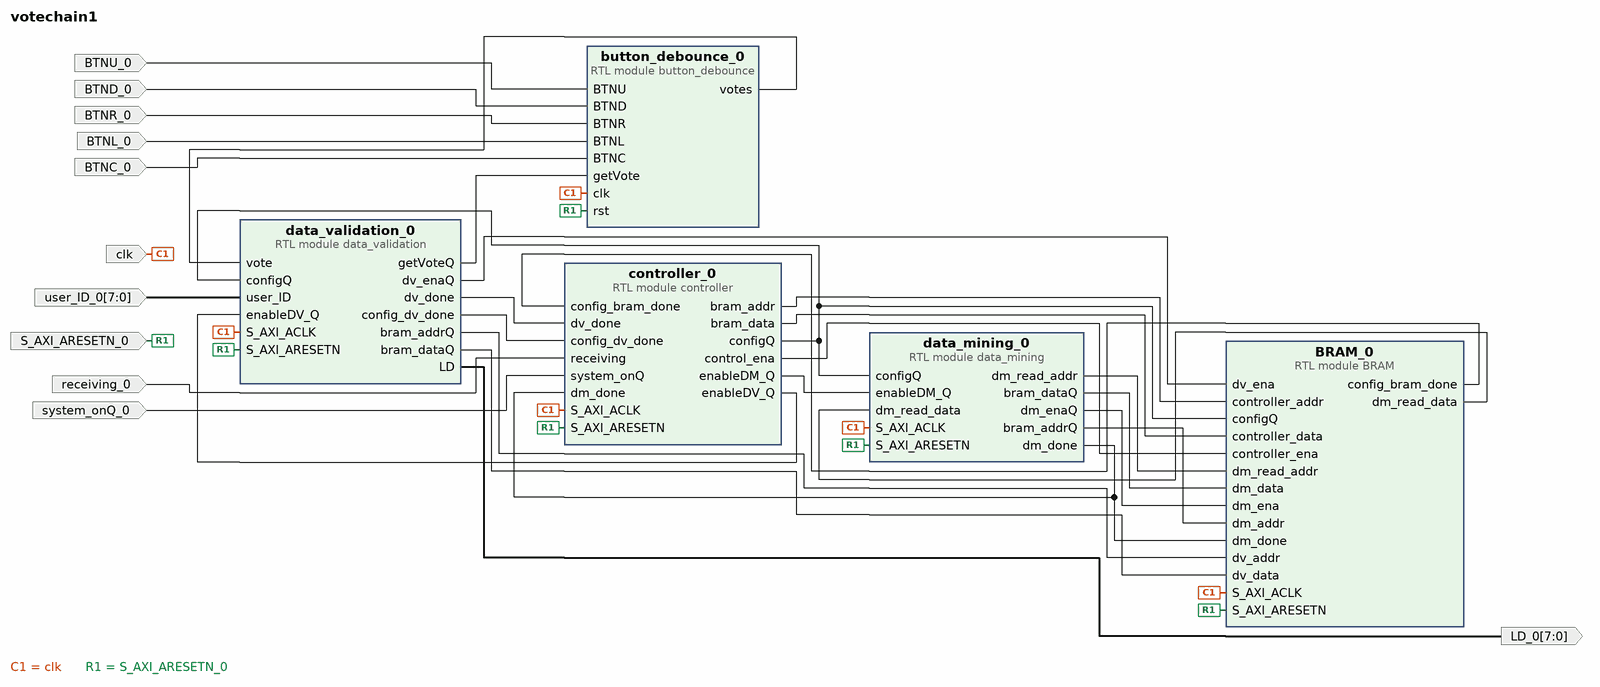
[diagram p0: block diagram of the top level]
# Vivado block design votechain1, xc7z020clg484-1, Vivado 2018.2
create_bd_design votechain1

create_bd_port -dir I BTNU_0
create_bd_port -dir I BTND_0
create_bd_port -dir I BTNR_0
create_bd_port -dir I BTNL_0
create_bd_port -dir I BTNC_0
create_bd_port -dir I -type clk clk
set_property -dict {CONFIG.FREQ_HZ 100000000} [get_bd_ports clk]
create_bd_port -dir I -type rst S_AXI_ARESETN_0
create_bd_port -dir I receiving_0
create_bd_port -dir I -from 7 -to 0 user_ID_0
create_bd_port -dir I system_onQ_0
create_bd_port -dir O -from 7 -to 0 LD_0

create_bd_cell -type module -reference button_debounce button_debounce_0
create_bd_cell -type module -reference BRAM BRAM_0
create_bd_cell -type module -reference data_validation data_validation_0
create_bd_cell -type module -reference data_mining data_mining_0
create_bd_cell -type module -reference controller controller_0

# ---- connections ----

connect_bd_net [get_bd_pins button_debounce_0/votes] [get_bd_pins data_validation_0/vote]
connect_bd_net -net BTNU_0_1 [get_bd_ports BTNU_0] [get_bd_pins button_debounce_0/BTNU]
connect_bd_net -net BTND_0_1 [get_bd_ports BTND_0] [get_bd_pins button_debounce_0/BTND]
connect_bd_net -net BTNR_0_1 [get_bd_ports BTNR_0] [get_bd_pins button_debounce_0/BTNR]
connect_bd_net -net BTNL_0_1 [get_bd_ports BTNL_0] [get_bd_pins button_debounce_0/BTNL]
connect_bd_net -net BTNC_0_1 [get_bd_ports BTNC_0] [get_bd_pins button_debounce_0/BTNC]
connect_bd_net -net S_AXI_ACLK_0_1 [get_bd_ports clk] \
  [get_bd_pins button_debounce_0/clk] [get_bd_pins BRAM_0/S_AXI_ACLK] [get_bd_pins data_validation_0/S_AXI_ACLK] \
  [get_bd_pins data_mining_0/S_AXI_ACLK] [get_bd_pins controller_0/S_AXI_ACLK]
connect_bd_net -net S_AXI_ARESETN_0_1 [get_bd_ports S_AXI_ARESETN_0] \
  [get_bd_pins button_debounce_0/rst] [get_bd_pins BRAM_0/S_AXI_ARESETN] [get_bd_pins data_validation_0/S_AXI_ARESETN] \
  [get_bd_pins data_mining_0/S_AXI_ARESETN] [get_bd_pins controller_0/S_AXI_ARESETN]
connect_bd_net [get_bd_pins data_validation_0/dv_done] [get_bd_pins controller_0/dv_done]
connect_bd_net [get_bd_pins data_validation_0/config_dv_done] [get_bd_pins controller_0/config_dv_done]
connect_bd_net [get_bd_pins BRAM_0/config_bram_done] [get_bd_pins controller_0/config_bram_done]
connect_bd_net -net receiving_0_1 [get_bd_ports receiving_0] [get_bd_pins controller_0/receiving]
connect_bd_net [get_bd_pins controller_0/bram_addr] [get_bd_pins BRAM_0/controller_addr]
connect_bd_net [get_bd_pins controller_0/bram_data] [get_bd_pins BRAM_0/controller_data]
connect_bd_net [get_bd_pins controller_0/control_ena] [get_bd_pins BRAM_0/controller_ena]
connect_bd_net [get_bd_pins controller_0/configQ] \
  [get_bd_pins BRAM_0/configQ] [get_bd_pins data_validation_0/configQ] [get_bd_pins data_mining_0/configQ]
connect_bd_net -net data_validation_0_dv_ena [get_bd_pins data_validation_0/dv_enaQ] [get_bd_pins BRAM_0/dv_ena]
connect_bd_net -net data_validation_0_bram_addr [get_bd_pins data_validation_0/bram_addrQ] [get_bd_pins BRAM_0/dv_addr]
connect_bd_net -net data_validation_0_bram_data [get_bd_pins data_validation_0/bram_dataQ] [get_bd_pins BRAM_0/dv_data]
connect_bd_net [get_bd_pins controller_0/enableDV_Q] [get_bd_pins data_validation_0/enableDV_Q]
connect_bd_net -net user_ID_0_1 [get_bd_ports user_ID_0] [get_bd_pins data_validation_0/user_ID]
connect_bd_net [get_bd_pins data_mining_0/dm_done] [get_bd_pins BRAM_0/dm_done] [get_bd_pins controller_0/dm_done]
connect_bd_net [get_bd_pins controller_0/enableDM_Q] [get_bd_pins data_mining_0/enableDM_Q]
connect_bd_net [get_bd_pins BRAM_0/dm_read_data] [get_bd_pins data_mining_0/dm_read_data]
connect_bd_net [get_bd_pins data_mining_0/dm_read_addr] [get_bd_pins BRAM_0/dm_read_addr]
connect_bd_net -net data_mining_0_bram_data [get_bd_pins data_mining_0/bram_dataQ] [get_bd_pins BRAM_0/dm_data]
connect_bd_net -net system_onQ_0_1 [get_bd_ports system_onQ_0] [get_bd_pins controller_0/system_onQ]
connect_bd_net [get_bd_pins data_validation_0/getVoteQ] [get_bd_pins button_debounce_0/getVote]
connect_bd_net [get_bd_pins data_validation_0/LD] [get_bd_ports LD_0]
connect_bd_net [get_bd_pins data_mining_0/dm_enaQ] [get_bd_pins BRAM_0/dm_ena]
connect_bd_net [get_bd_pins data_mining_0/bram_addrQ] [get_bd_pins BRAM_0/dm_addr]

validate_bd_design
save_bd_design
